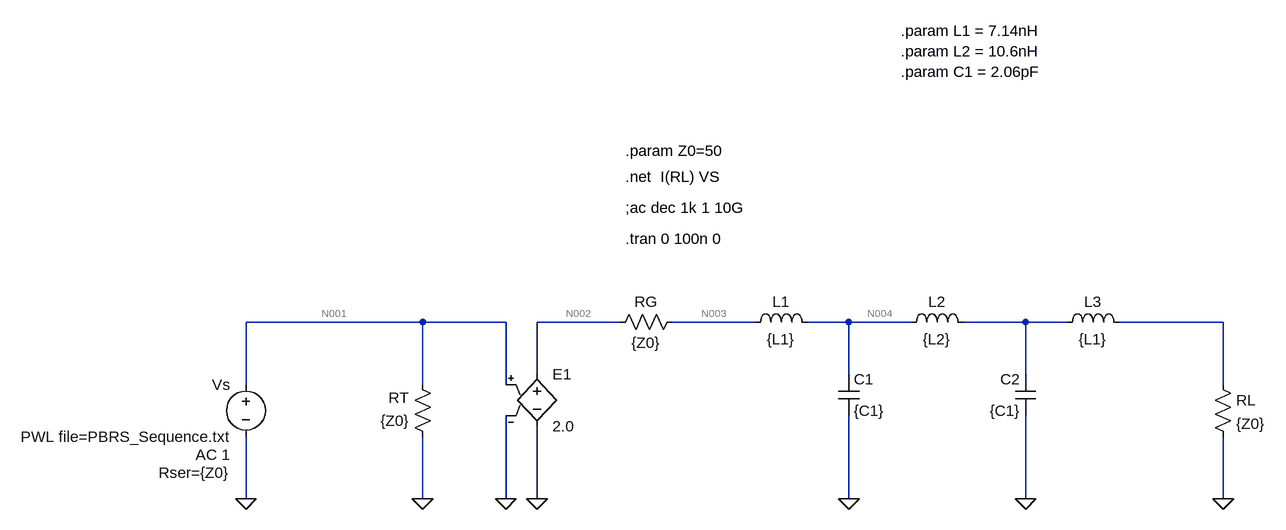
[diagram p0: schematic 1p75GHz_Pulse_Shaping_Filter.asc]
1p75GHz_Pulse_Shaping_Filter.asc, the LTspice schematic file:
Version 4
SHEET 1 928 680
WIRE -384 -96 -656 -96
WIRE -256 -96 -384 -96
WIRE -80 -96 -208 -96
WIRE 128 -96 0 -96
WIRE 272 -96 208 -96
WIRE 368 -96 272 -96
WIRE 544 -96 448 -96
WIRE 608 -96 544 -96
WIRE 848 -96 688 -96
WIRE -208 -16 -208 -96
WIRE 272 -16 272 -96
WIRE 544 -16 544 -96
WIRE -656 0 -656 -96
WIRE -384 0 -384 -96
WIRE -256 0 -256 -96
WIRE 848 0 848 -96
WIRE -656 176 -656 80
WIRE -384 176 -384 80
WIRE -256 176 -256 48
WIRE -208 176 -208 64
WIRE 272 176 272 48
WIRE 544 176 544 48
WIRE 848 176 848 80
FLAG 848 176 0
FLAG -656 176 0
FLAG 272 176 0
FLAG 544 176 0
FLAG -208 176 0
FLAG -256 176 0
FLAG -384 176 0
SYMBOL voltage -656 -16 M0
WINDOW 123 24 124 Left 2
WINDOW 39 24 152 Left 2
SYMATTR Value2 AC 1
SYMATTR SpiceLine Rser={Z0}
SYMATTR InstName Vs
SYMATTR Value PWL file=PBRS_Sequence.txt
SYMBOL ind 112 -80 R270
WINDOW 0 32 56 VTop 2
WINDOW 3 5 56 VBottom 2
SYMATTR InstName L1
SYMATTR Value {L1}
SYMBOL cap 256 -16 R0
SYMATTR InstName C1
SYMATTR Value {C1}
SYMBOL ind 352 -80 R270
WINDOW 0 32 56 VTop 2
WINDOW 3 5 56 VBottom 2
SYMATTR InstName L2
SYMATTR Value {L2}
SYMBOL res 832 -16 R0
SYMATTR InstName RL
SYMATTR Value {Z0}
SYMBOL ind 704 -80 M270
WINDOW 0 32 56 VTop 2
WINDOW 3 5 56 VBottom 2
SYMATTR InstName L3
SYMATTR Value {L1}
SYMBOL cap 560 -16 M0
SYMATTR InstName C2
SYMATTR Value {C1}
SYMBOL e -208 -32 R0
SYMATTR InstName E1
SYMATTR Value 2.0
SYMBOL res 16 -112 R90
WINDOW 0 0 56 VBottom 2
WINDOW 3 32 56 VTop 2
SYMATTR InstName RG
SYMATTR Value {Z0}
SYMBOL res -368 96 R180
WINDOW 0 36 76 Left 2
WINDOW 3 36 40 Left 2
SYMATTR InstName RT
SYMATTR Value {Z0}
TEXT -72 -320 Left 2 !.net  I(RL) VS
TEXT -72 -360 Left 2 !.param Z0=50
TEXT -72 -272 Left 2 !;ac dec 1k 1 10G
TEXT -72 -224 Left 2 !.tran 0 100n 0
TEXT 352 -544 Left 2 !.param L1 = 7.14nH\n.param L2 = 10.6nH\n.param C1 = 2.06pF

The netlist it stands for:
* 1p75GHz_Pulse_Shaping_Filter.asc
Vs N001 0 PWL file=PBRS_Sequence.txt AC 1 Rser={Z0}
L1 N003 N004 {L1}
C1 N004 0 {C1}
L2 N004 N005 {L2}
RL N006 0 {Z0}
L3 N006 N005 {L1}
C2 N005 0 {C1}
E1 N002 0 N001 0 2.0
RG N003 N002 {Z0}
RT 0 N001 {Z0}
.net  I(RL) VS
.param Z0=50
;ac dec 1k 1 10G
.tran 0 100n 0
.param L1 = 7.14nH
.param L2 = 10.6nH
.param C1 = 2.06pF
.backanno
.end

* Results of the author's LTspice run, read from the files saved beside the schematic
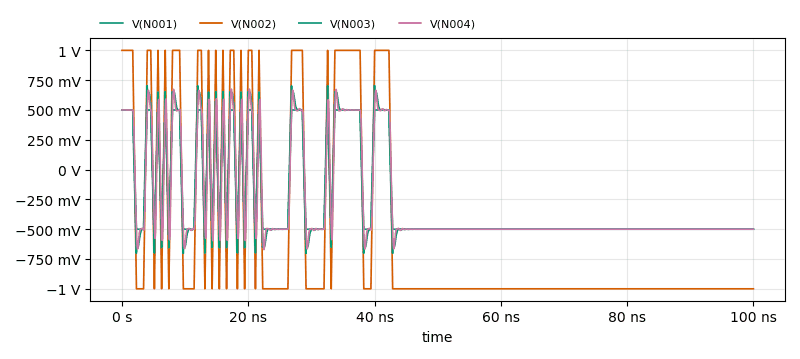
[diagram p1: Transient Analysis of 1p75GHz_Pulse_Shaping_Filter.asc, plotted from the saved traces]
* Transient Analysis, 1 run:
*   V(N001): min -500 mV, max 500 mV, average -274.3 mV, rms 467.7 mV, last -500 mV
*   V(N002): min -1 V, max 1 V, average -548.6 mV, rms 935.4 mV, last -1 V
*   V(N003): min -704.3 mV, max 704.3 mV, average -275.8 mV, rms 489.2 mV, last -500 mV
*   V(N004): min -671.7 mV, max 675.7 mV, average -274.4 mV, rms 487.6 mV, last -500 mV